# EAGLE design 通過_IC (EAGLE 9.6.1)
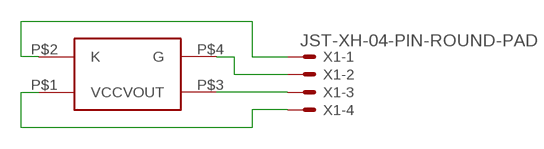
[diagram p0: schematic, sheet 1]

## Parts
U$1  S4282-51  [S4282-51]
X1  JST-XH-04-PIN-ROUND-PAD  [JST-XH-04-PACKAGE-ROUND-PAD]

## Nets
N$1: U$1.P$3(VOUT) X1.3
N$2: U$1.P$4(G) X1.2
N$3: U$1.P$2(K) X1.1
N$4: U$1.P$1(VCC) X1.4

## Library data of the parts
U$1 = by_hirame:S4282-51
X1 = Rembrandt Electronics - JST XH Connectors v1-0:JST-XH-04-PIN: JST XH Connector 2 Pin Wire to board connector. Pitch: 2,54 mm, (0.100") Number of pins: 4 Created by Rembrandt Electronics www.rembrandtelectronics.com

## Board
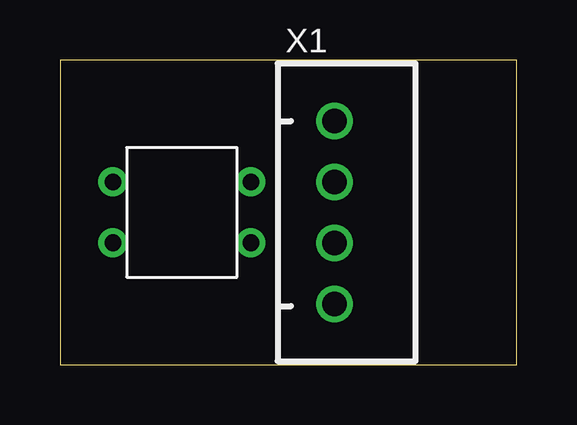
[diagram p1: board, top side]
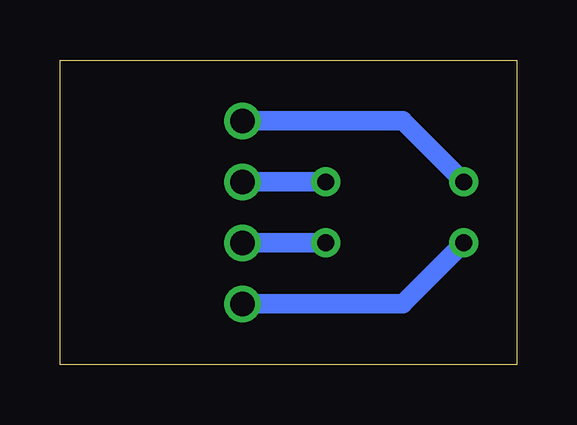
[diagram p2: board, bottom side, seen from below]

Size 19.03 x 12.7 mm. Coordinates in mm from the lower left corner, seen from the top.
Outline: 0,0 19.03,0 19.03,12.7 0,12.7 0,0
Copper layers (1*16): Top 0.035mm / dielectric 1.5mm / Bottom 0.035mm
Design rules "default": minimum track width 6mil, minimum drill 0.35mm, track to track 6mil, track to pad 6mil, pad to pad 6mil, via to via 6mil, smd to smd 6mil, copper to edge 40mil, drill to drill 6mil, minimum pad ring 10mil, minimum via ring 8mil, stop-mask expansion 4mil, vias tented up to drill 0mil, thermal gap 10mil

### Footprints (pad centres in the part's own frame; a part is rotated, then mirrored left to right if it is on the bottom)
S4282-51 = drill 0.7: P$1 -2.875,-1.27; P$2 -2.875,1.27; P$3 2.875,-1.27; P$4 2.875,1.27
JST-XH-04-PACKAGE-ROUND-PAD = drill 1.016: 1 -3.81,0; 2 -1.27,0; 3 1.27,0; 4 3.81,0

### Placement (x,y rotation side)
U$1  5.08,6.35 0 top
X1  11.43,6.35 270 top

### Tracks (layer width: path | path; a pad name or v marks a point on that pad's centre or on a via)
N$1
  Bottom 0.813: U$1.P$3 X1.3
N$2
  Bottom 0.813: X1.2 U$1.P$4
N$3
  Bottom 0.813: U$1.P$2 4.75,10.16 X1.1
N$4
  Bottom 0.813: U$1.P$1 4.75,2.54 X1.4